# Altium schematic sheet ESP32_SENSORS.SchDoc
size A4; SheetNumber: 2; SheetTotal: 3
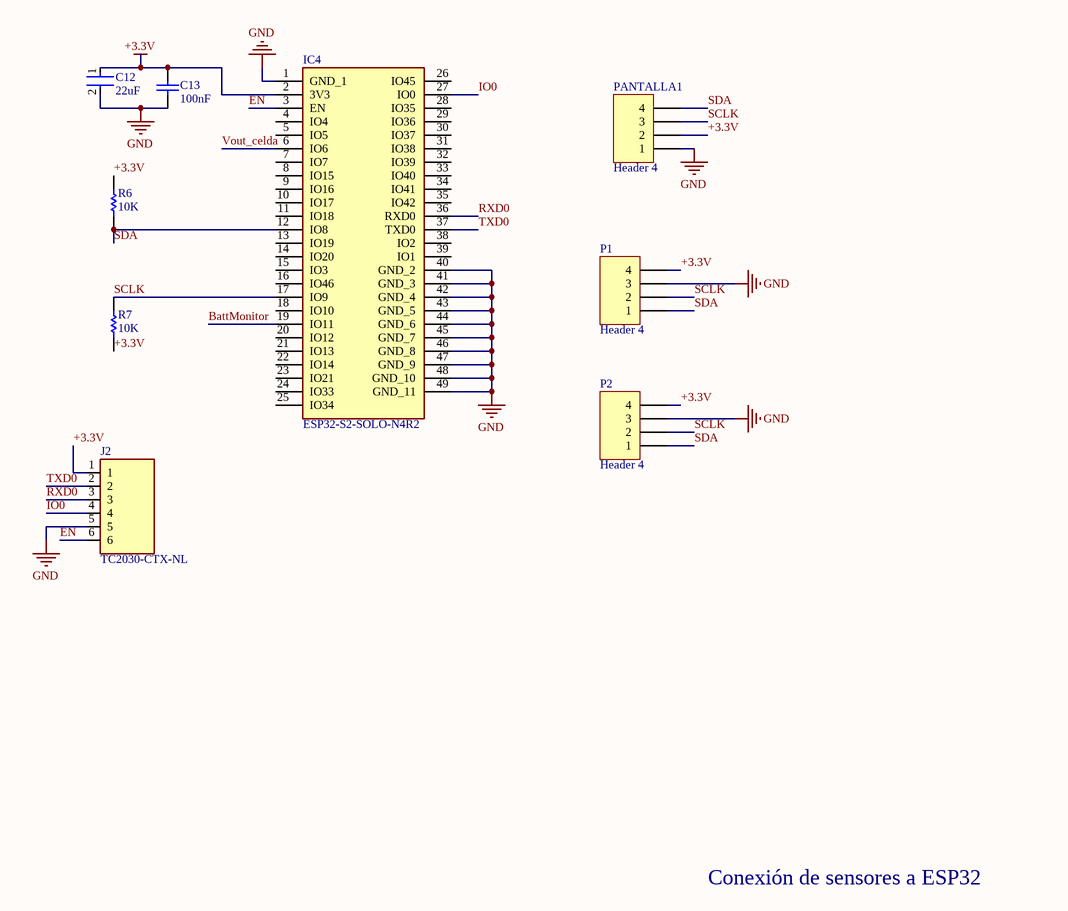
[diagram p0: ESP32_SENSORS.SchDoc]

## Parts
C12  22uF  [FP-GRM188-0_2-IPC_C]
C13  100nF  [CAPC1608X90X35NL10T15]
IC4  ESP32-S2-SOLO-N4R2  [ESP32S2SOLON4R2]
J2  TC2030-CTX-NL  [TC2030MCPNL10]
P1  Header 4  [HDR1X4]
P2  Header 4  [HDR1X4]
PANTALLA1  Header 4  [HDR1X4]
R6  10K  [RESC1609X55X30LL15T15]
R7  10K  [RESC1609X55X30LL15T15]

## Nets
+3.3V: C12.1 C13.2 IC4.2(3V3) J2.1 P1.4 P2.4 PANTALLA1.2 R6.1 R7.1
GND: C12.2 C13.1 IC4.1(GND_1) IC4.40(GND_2) IC4.41(GND_3) IC4.42(GND_4) IC4.43(GND_5) IC4.44(GND_6) IC4.45(GND_7) IC4.46(GND_8) IC4.47(GND_9) IC4.48(GND_10) IC4.49(GND_11) J2.5 P1.3 P2.3 PANTALLA1.1
BattMonitor: IC4.19(IO11)
EN: IC4.3(EN) J2.6
IO0: IC4.27(IO0) J2.4
RXD0: IC4.36(RXD0) J2.3
SCLK: IC4.17(IO9) P1.2 P2.2 PANTALLA1.3 R7.2
SDA: IC4.12(IO8) P1.1 P2.1 PANTALLA1.4 R6.2
TXD0: IC4.37(TXD0) J2.2
Vout_celda: IC4.6(IO6)

Not connected (* = marked no-connect by the designer): IC4 4(IO4) 5(IO5) 7(IO7) 8(IO15) 9(IO16) 10(IO17) 11(IO18) 13(IO19) 14(IO20) 15(IO3) 16(IO46) 18(IO10) 20(IO12) 21(IO13) 22(IO14) 23(IO21) 24(IO33) 25(IO34) 26(IO45) 28(IO35) 29(IO36) 30(IO37) 31(IO38) 32(IO39) 33(IO40) 34(IO41) 35(IO42) 38(IO2) 39(IO1)

## Notes on the sheet
- Conexión de sensores a ESP32

## Library data of the parts
C12 = CMP-2006-02545-2: Chip Multilayer Ceramic Capacitors for General Purpose, 0603, 4.7uF, X5R, 15%, 10%, 35V; Lead Free: Lead Free; Max Operating Temperature: 85°C; Case Code (Imperial): 0603; Capacitance: 4.7uF; Width: 0.8mm; Thickness: 0.031inch; Case Code (Metric): 1608; Min Operating Temperature: -55°C; Voltage Rating (DC): 35V; Dielectric: X5R; Voltage: 35V; Packaging: Tape and Reel; Resistor Type: Ceramic; Weight: 0.000222oz; Mount: Surface Mount; Material: Ceramic; Depth: 0.8mm; Tolerance: 10%; REACH SVHC: No SVHC; Case/Package: 0603; Voltage Rating: 35V; Package Quantity: 4000; Height: 0.8mm; Length: 1.6mm; Termination: SMD/SMT
C13 = CMP-2006-02777-1: Manufacturer: Murata; Part Number: GRM188F51E104ZA01D
IC4 = ESP32-S2-SOLO-N4R2: Integrated Circuit; Manufacturer_Name: Espressif Systems; Datasheet Link: https://www.espressif.com/sites/default/files/documentation/esp32-s2-solo_esp32-s2-solo-u_datasheet_en.pdf; Height: 3.25mm; Manufacturer_Part_Number: ESP32-S2-SOLO-N4R2; Mouser Part Number: 356-ESP32-S2SOLON4R2; Mouser Price/Stock: https://www.mouser.co.uk/ProductDetail/Espressif-Systems/ESP32-S2-SOLO-N4R2?qs=pBJMDPsKWf0j4qPDQHWJuA%3D%3D
J2 = TC2030-CTX-NL: Connector; Manufacturer: Tag Connect; Datasheet Link: http://www.tag-connect.com/Materials/TC2030-CTX.pdf; Height: 18mm; Manufacturer Product Number: TC2030-CTX-NL
P1 P2 PANTALLA1 = Header 4: Header, 4-Pin; LatestRevisionDate: 17-Jul-2002; LatestRevisionNote: Re-released for DXP Platform.; Publisher: Altium Limited
R6 R7 = CMP-1012-00623-3: Chip Resistor, 10 KOhm, +/- 1%, 0.1 W, -55 to 155 degC, 0603 (1608 Metric), RoHS, Tape and Reel; Manufacturer: Panasonic; Voltage Rating: 75V; Case\/Package: 0603; Power Rating: 100mW; Resistance: 10KOhm; Temperature Coefficient: 100ppm\/degreesC; Number of Pins: 2; Package Reference: 603; Depth: 0.8mm; Mount: SurfaceMount; Package Description: 2-Pin Surface Mount Device, Body 1.6 x 0.85 mm; Datasheet Version: 02/2017; Length: 1.6mm; Lead Free: LeadFree; Height: 0.45mm; Number of Terminations: 2; Max Power Dissipation: 100mW; Min Operating Temperature: -55degC; Datasheet URL: https://industrial.panasonic.com/cdbs/www-data/pdf/RDA0000/AOA0000C304.pdf; Termination: SMD/SMT; Case Code (Metric): 1608; Case Code (Imperial): 0603; Tolerance: 1%; Max Operating Temperature: 155degC; RoHSCompliant: true; Voltage Rating (DC): 75V; Radiation Hardening: No; Packaging: TapeandReel; Composition: ThickFilm; Mounting Technology: SurfaceMount; Manufacturer URL: http://www.panasonic.com/; Width: 0.031inch; REACH SVHC: NoSVHC; Contact Plating: Tin; Military Standard: Not; Package Quantity: 1